# Altium schematic sheet Serial_and_JTAG.SchDoc
size A
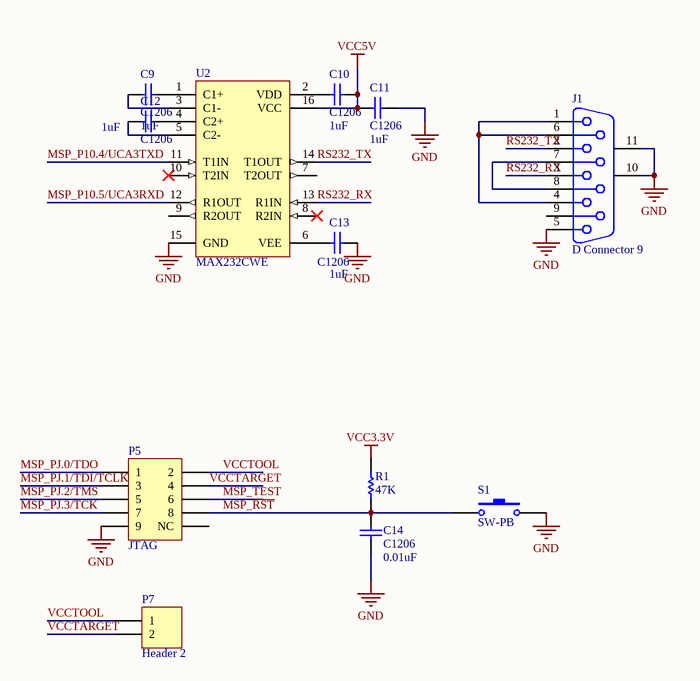
[diagram p0: Serial_and_JTAG.SchDoc]

## Parts
C9  C1206  value 1uF  [1206]
C10  C1206  value 1uF  [1206]
C11  C1206  value 1uF  [1206]
C12  C1206  value 1uF  [1206]
C13  C1206  value 1uF  [1206]
C14  C1206  value 0.01uF  [1206]
J1  D Connector 9  [DSUB1.385-2H9]
P5  JTAG  [HDR2X5]
P7  Header 2  [HDR1X2]
R1  47K  [8-1206]
S1  SW-PB  [SPST-2]
U2  MAX232CWE  [WSO16_N]

## Nets
GND: C11.2 C13.2 C14.1 J1.5 J1.10(MH1) J1.11(MH2) P5.9 S1.2 U2.15(GND)
VCC3.3V: R1.2
VCC5V: C10.2 C11.1 U2.16(VCC)
MSP_P10.4/UCA3TXD: U2.11(T1IN)
MSP_P10.5/UCA3RXD: U2.12(R1OUT)
MSP_PJ.0/TDO: P5.1
MSP_PJ.1/TDI/TCLK: P5.3
MSP_PJ.2/TMS: P5.5
MSP_PJ.3/TCK: P5.7
MSP_~{RST}: C14.2 P5.8 R1.1 S1.1
MSP_TEST: P5.6
RS232_RX: J1.3 U2.13(R1IN)
RS232_TX: J1.2 U2.14(T1OUT)
VCCTARGET: P5.4 P7.2
VCCTOOL: P5.2 P7.1
NetC9_1: C9.1 U2.3(C1-)
NetC9_2: C9.2 U2.1(C1+)
NetC10_1: C10.1 U2.2(VDD)
NetC12_1: C12.1 U2.5(C2-)
NetC12_2: C12.2 U2.4(C2+)
NetC13_1: C13.1 U2.6(VEE)
NetJ1_1: J1.1 J1.4 J1.6
NetJ1_7: J1.7 J1.8

Not connected (* = marked no-connect by the designer): J1 9; P5 10(NC); U2 7(T2OUT) 8(R2IN)* 9(R2OUT) 10(T2IN)*

## Library data of the parts
C9-C14 = C1206: Ceramic Chip Capacitor - Standard; Published: 17-Jul-2002; LatestRevisionDate: 19-Mar-2004; LatestRevisionNote: Silkscreen size reduced.; DatasheetDocument: Mar-2001; PackageDocument: Mar-2001; PackageReference: 1206; Publisher: Altium Limited; Code_JEITA: 1206; Code_IPC: 3216 [1206]; ComponentLink1Description: Manufacturer Link; ComponentLink1URL: http://www.kemet.com/; ComponentLink2Description: Datasheet; ComponentLink2URL: http://www.kemet.com/kemet/web/homepage/kechome.nsf/vapubfilesname/F3102TA.pdf/$file/F3102TA.pdf
J1 = D Connector 9: Receptacle Assembly, 9 Position, Right Angle; PackageDocument: O; Positions: 9; Published: 15-Jun-2001; LatestRevisionDate: 17-Jul-2002; LatestRevisionNote: Re-released for DXP Platform.; DatasheetDocument: 1-Sep-1999; PackageReference: 788750; Publisher: Altium Limited; Orientation: Right Angle; Gender: Receptacle
P5 = Header 5X2: Header, 5-Pin, Dual row; LatestRevisionDate: 17-Jul-2002; LatestRevisionNote: Re-released for DXP Platform.; Publisher: Altium Limited
P7 = Header 2: Header, 2-Pin; LatestRevisionDate: 17-Jul-2002; LatestRevisionNote: Re-released for DXP Platform.; Publisher: Altium Limited
R1 = ERJ8EN: Precision Thick Film Chip Resistor, 10 Ohm to 2.2M Ohm Range, 1% Tolerance, 1206 Size, 0.125 W; Published: 17-Dec-2003; LatestRevisionDate: 19-Mar-2004; LatestRevisionNote: Silkscreen size reduced.; PackageDocument: Mar-2003; PackageReference: 8-1206; Publisher: Altium Limited; Code_IPC: 3216 [1206]; ComponentLink1Description: Manufacturer Link; ComponentLink1URL: http://www.panasonic.com/industrial/components/resistive_products.htm; ComponentLink2Description: Datasheet; ComponentLink2URL: http://www.panasonic.com/industrial/components/pdf/AOA0000CE2.pdf
S1 = SW-PB: Switch; Published: 24-Mar-1999; LatestRevisionDate: 17-Jul-2002; LatestRevisionNote: Re-released for DXP Platform.; PackageReference: SPST-2; Publisher: Altium Limited
U2 = MAX232CWE: +5V Powered RS-232 Driver/Receiver; Published: 16-Jan-2001; LatestRevisionDate: 13-Apr-2006; LatestRevisionNote: IPC-7351 Footprint Added.; DatasheetVersion: Apr-1992; PackageReference: WSO16; Publisher: Altium Limited; PackageDescription: 16-Pin Small Outline Integrated Circuit 1.27 mm Pitch; Code_JEDEC: MS-013-AA; Code_IPC: SOIC127P1030-16; ComponentLink1Description: Manufacturer Link; ComponentLink1URL: http://www.maxim-ic.com/; ComponentLink2Description: Datasheet; ComponentLink2URL: http://pdfserv.maxim-ic.com/en/ds/MAX220-MAX249.pdf